# Altium schematic sheet SMPS 1000mA - LM22672.SchDoc: SMPS 5v 1A - low ripple
size A4; Organization: Altium Limited; Address1: 3 Minna Close; Address2: Belrose; Address3: NSW 2085; Address4: Australia
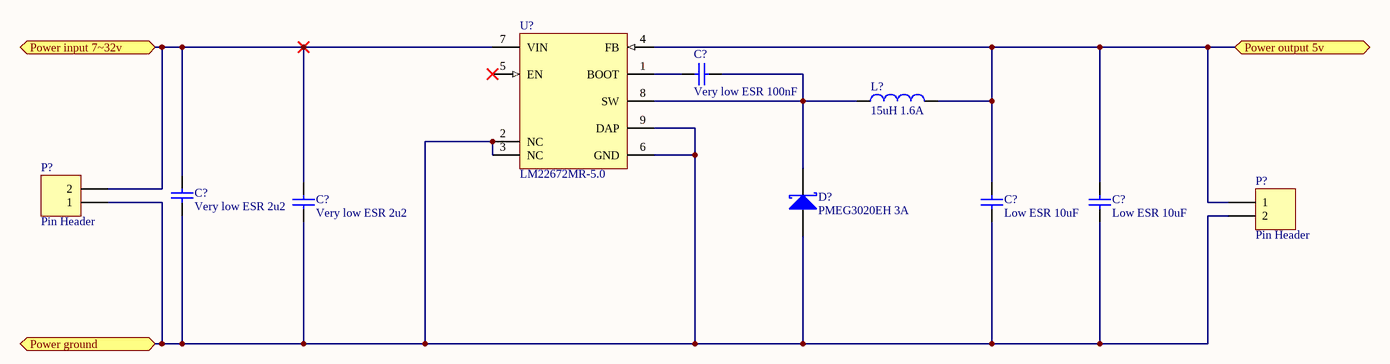
[diagram p0: SMPS 1000mA - LM22672.SchDoc]

## Parts
(Parts that share a designator on the sheet are numbered #1, #2 ... from top to bottom, then left to right.)
C?#1  Very low ESR 100nF  [C0805]
C?#2  Very low ESR 2u2  [C1210]
C?#3  Very low ESR 2u2  [C1210]
C?#4  Low ESR 10uF  [C1210]
C?#5  Low ESR 10uF  [C1210]
D?  PMEG3020EH 3A  [SOD123F]
L?  value 15uH 1.6A  [Square_7.3x7.3x4.5]  (hidden comment: inductor)
P?#1  Pin Header  [PH1x2_2.54]
P?#2  Pin Header  [PH1x2_2.54]
U?  LM22672MR-5.0  [MRA08B_N]

## Ports
Power ground, Power input 7~32v, Power output 5v

## Nets
Power ground: C?#2.1 C?#3.1 C?#4.1 C?#5.1 D?.1 P?#1.1 P?#2.2 U?.2(NC) U?.3(NC) U?.6(GND) U?.9(DAP) ; port Power ground
Power input 7~32v: C?#2.2 C?#3.2 P?#1.2 U?.7(VIN) ; port Power input 7~32v
Power output 5v: C?#4.2 C?#5.2 L?.2 P?#2.1 U?.4(FB) ; port Power output 5v
NetC?#1_1: C?#1.1 U?.1(BOOT)
NetC?#1_2: C?#1.2 D?.2 L?.1 U?.8(SW)

Not connected (* = marked no-connect by the designer): U? 5(EN)*

## Notes on the sheet
- Disclaimer
  Any design and information, hardware or software  is provided on an "as-is" basis without warranty of any kind and any express or implied warranties, including, but not limited to, the implied warranties of merchantability and fitness for a particular purpose are disclaimed. In no event shall wnpd (or KeaDrone)be liable for any direct, indirect, incidental, special, exemplary, or consequential damages (including, but not limited to, procurement of substitute goods or services; loss of use, data, or profits; or business interruption) however caused and on any theory of liability, whether in contract, strict liability, or tort (including negligence or otherwise) arising in any way out of the use of this firmware, hardware, software or information, even if wnpd (or KeaDrone) has been advised by user of the possibility of such potential loss or damage. The user agrees to hold wnpd (or KeaDrone) harmless from and against any and all claims, losses, liabilities and expenses.
- Title
- Size:
- Date:
- A4
- Name:
- Time:
- Ing. W. Pietersz
- Revision:
- Sheet
- of
- WillyPietersz@gmail.com
- Contact:
- -
- www.wnpd.nl
- File:

## Library data of the parts
C?#1 = 0.01uF-0805-X7R: Voltage: 50V; Type: X7R; Tolerance: 0.1; Part Number: 0.01uF-0805-X7R; Value: 0.01uF-0805-X7R; Package: 0805; Component Type: Low ESR; LatestRevision Date: 14-9-2010; Author: Willem Pietersz; Supplier 2: Farnell; Supplier Part Number 2: 1692287
C?#2 C?#3 = 2.2uF-1210-X7R: Voltage: 50V; Type: X7R; Tolerance: 0.1; Part Number: 2.2uF-1210-X7R; Value: 2.2uF-1210-X7R; Package: 1210; Component Type: Low ESR; LatestRevision Date: 14-9-2010; Author: Willem Pietersz; Supplier 2: Farnell; Supplier Part Number 2: 1414066
C?#4 C?#5 = 10uF-1210-X5R: Voltage: 10V; Type: X5R; Tolerance: 0.1; Part Number: 10uF-1210-X5R; Value: 10uF-1210-X5R; Package: 1210; Component Type: Low ESR; LatestRevision Date: 14-9-2010; Author: Willem Pietersz; Supplier 2: Farnell; Supplier Part Number 2: 1759458
D? = PMEG3020EH: Voltage: 30V; Current: 2A; Part Number: PMEG3020EH; Type: Schottky; Component Type: Standard; Supplier 2: Farnell; Supplier Part Number 2: 1510687; ComponentLink2Description: Datasheet; ComponentLink2URL: http://www.nxp.com/documents/data_sheet/PMEG3020EH_EJ.pdf
L? = 15uH-Shield-1.6A-Wurth: Type: Shielded; Part Number: 15uH-Shield-1.6A-Wurth; Supplier 2: Farnell; Supplier Part Number 2: 1635989; ComponentLink2Description: Datasheet; ComponentLink2URL: http://www.farnell.com/datasheets/69698.pdf
P?#1 P?#2 = PH1x2: Con1x2; Part Number: PH1x2; Pitch: 2.54; LatestRevision Note: Initial Release; Type: Pin Header; Number Of Pins: 2; Component Type: Standard; LatestRevision Date: 23-11-2010; Author: Willy Pietersz; Supplier 2: Farnell
U? = LM22674MR-5.0: Power, 500mA SIMPLE SWITCHER, Step-Down Voltage Regulator with Precision Enable; Manufacturer: National Semiconductor; PackageTopMarking: NSXYTT*L22674*5.0; PowerWise: N; FirstPublished: 4-Dec-2008; DatasheetVersion: Oct-2008; PackageVersion: revB, Dec-2007; PackageReference: MRA08B; Publisher: Altium Limited; PackageDescription: Molded, PSOP .193 x .154 x .058in, 8 Lead, .050in Pitch, Large DAP; CompType: Switcher; PartNumber: LM22674MR-5.0; RoHS: Y; PinCount: 8; DigiKeyPartNumber: LM22674MR-5.0-ND; Code_JEDEC: MS-012-AA; ComponentLink1Description: LM22674 Datasheet; ComponentLink1URL: http://www.national.com/ds/LM/LM22674.pdf; ComponentLink2Description: LM22674 Web Page; ComponentLink2URL: http://www.national.com/pf/LM/LM22674.html; ComponentLink3Description: MRA08B Package Drawing; ComponentLink3URL: http://www.national.com/packaging/folders/mra08b.html